# Altium schematic sheet Digital Inputs.SchDoc
size A4
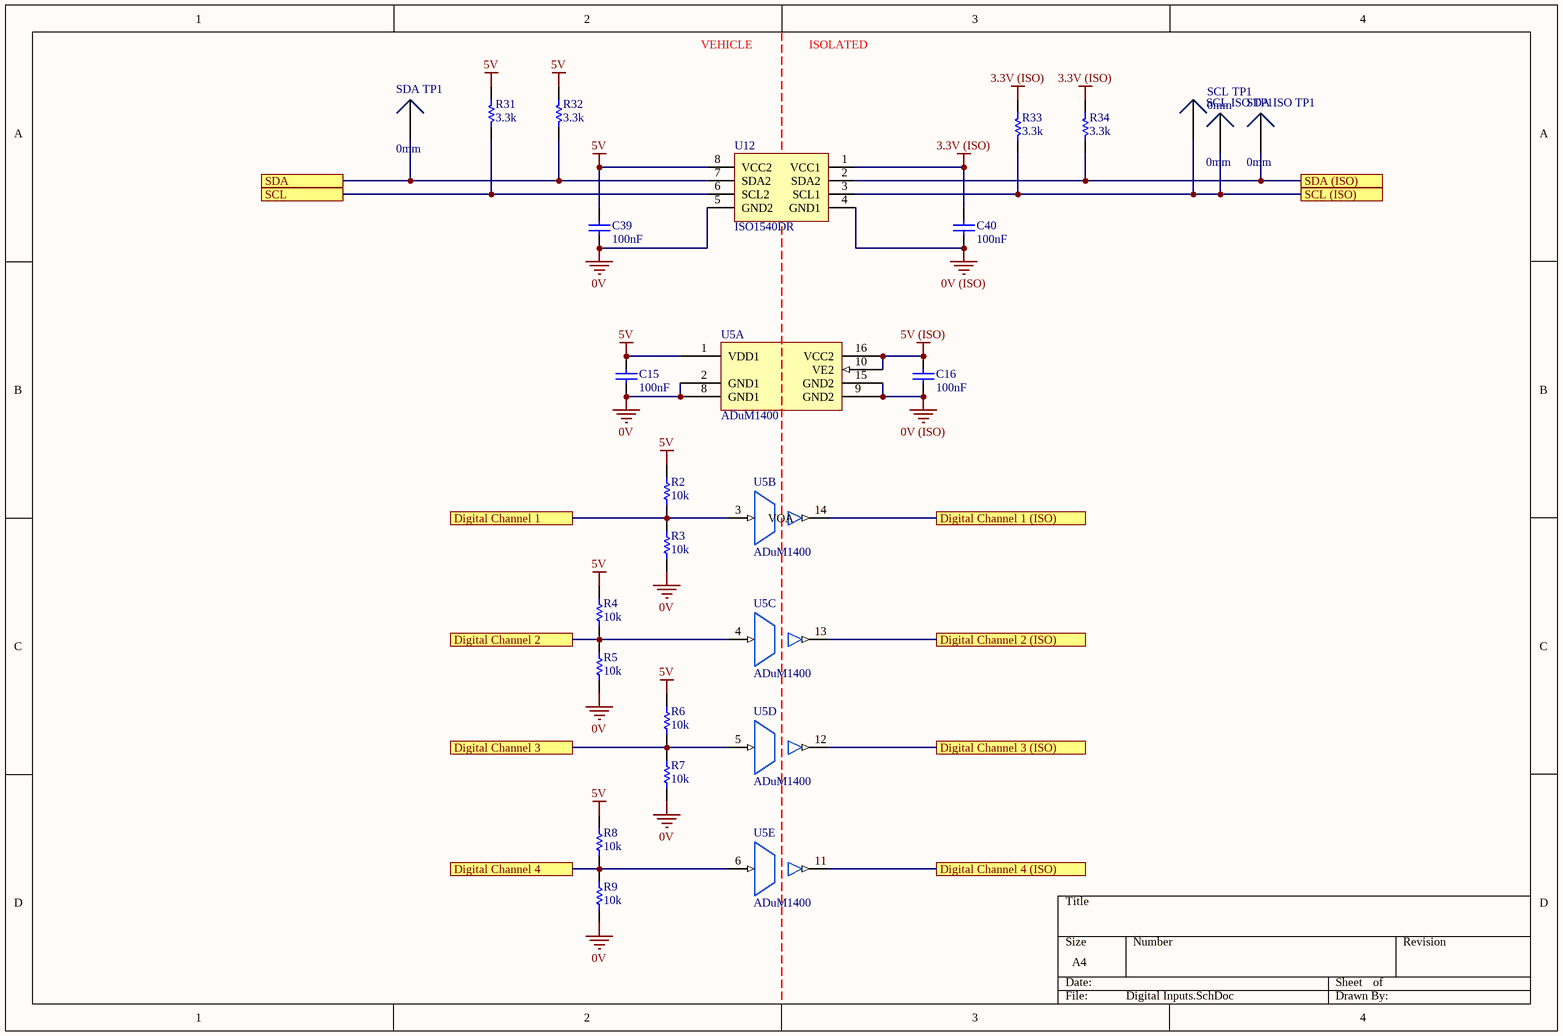
[diagram p0: Digital Inputs.SchDoc]

## Parts
C15  100nF  [0805]
C16  100nF  [0805]
C39  100nF  [0805]
C40  100nF  [0805]
R2  10k  [0805]
R3  10k  [0805]
R4  10k  [0805]
R5  10k  [0805]
R6  10k  [0805]
R7  10k  [0805]
R8  10k  [0805]
R9  10k  [0805]
R31  3.3k  [0805]
R32  3.3k  [0805]
R33  3.3k  [0805]
R34  3.3k  [0805]
SCL_ISO_TP1  0mm  [SMD Test Point]
SCL_TP1  0mm  [SMD Test Point]
SDA_ISO_TP1  0mm  [SMD Test Point]
SDA_TP1  0mm  [SMD Test Point]
U5  ADuM1400  [AD 16-SOIC]  (parts A,B,C,D,E of 5)
U12  ISO1540DR  [TI 8-SOIC]

## Ports
Digital Channel 1, Digital Channel 1 (ISO), Digital Channel 2, Digital Channel 2 (ISO), Digital Channel 3, Digital Channel 3 (ISO), Digital Channel 4, Digital Channel 4 (ISO), SCL, SCL (ISO), SDA, SDA (ISO)

## Nets
0V: C15.1 C39.1 R3.1 R5.1 R7.1 R9.1 U5.2(GND1) U5.8(GND1) U12.5(GND2)
0V (ISO): C16.1 C40.1 U5.9(GND2) U5.15(GND2) U12.4(GND1)
3.3V (ISO): C40.2 R33.2 R34.2 U12.1(VCC1)
5V: C15.2 C39.2 R2.2 R4.2 R6.2 R8.2 R31.2 R32.2 U5.1(VDD1) U12.8(VCC2)
5V (ISO): C16.2 U5.10(VE2) U5.16(VCC2)
Digital Channel 1: R2.1 R3.2 U5.3(VIA) ; port Digital Channel 1
Digital Channel 1 (ISO): U5.14(VOA) ; port Digital Channel 1 (ISO)
Digital Channel 2: R4.1 R5.2 U5.4(VIB) ; port Digital Channel 2
Digital Channel 2 (ISO): U5.13(VOB) ; port Digital Channel 2 (ISO)
Digital Channel 3: R6.1 R7.2 U5.5(VIC) ; port Digital Channel 3
Digital Channel 3 (ISO): U5.12(VOC) ; port Digital Channel 3 (ISO)
Digital Channel 4: R8.1 R9.2 U5.6(VID) ; port Digital Channel 4
Digital Channel 4 (ISO): U5.11(VOD) ; port Digital Channel 4 (ISO)
SCL: R31.1 U12.6(SCL2) ; port SCL
SCL (ISO): R33.1 SCL_ISO_TP1.1 SCL_TP1.1 U12.3(SCL1) ; port SCL (ISO)
SDA: R32.1 SDA_TP1.1 U12.7(SDA2) ; port SDA
SDA (ISO): R34.1 SDA_ISO_TP1.1 U12.2(SDA2) ; port SDA (ISO)

## Notes on the sheet
- VEHICLE
- ISOLATED

## Library data of the parts
C15 C16 C39 C40 = GCM21BR71E104KA37L: Manufacturer: muRata; Tolerance: 10%; Material: X7R; Rated Voltage: 25V; Part Number: GCM21BR71E104KA37L; Value: 100nF
R2-R9 = RC0805FR0710KL: Manufacturer: YAGEO; Tolerance: 0.01; Rated Voltage: 0.125W; Part Number: RC0805FR0710KL; Value: 10k; Material: FR-07
R31-R34 = RC0805FR073K3L: Manufacturer: YAGEO; Tolerance: 0.01; Rated Voltage: 0.125W; Part Number: RC0805FR073K3L; Value: 3.3k; Material: FR-07
SCL_ISO_TP1 SCL_TP1 SDA_ISO_TP1 SDA_TP1 = SMD Test Point: Positions: 1; Row Spacing: 0; Flange: No; Contact: NA; Part Number: SMD Test Point; Pitch: 0mm; Angle: 0
U5 = ADuM1400: General Purpose Digital Isolator 2500Vrms 4 Channel 1Mbps 25kV/µs CMTI 16-SOIC (0.295", 7.50mm Width); Manufacturer: Analog Devices; Part Number: ADuM1400; Digikey Part Number: ADUM1400WSRWZ-ND; Digikey Link: https://www.digikey.com/product-detail/en/analog-devices-inc/ADUM1400WSRWZ/ADUM1400WSRWZ-ND/1873713
U12 = ISO1540DR: I2C Digital Isolator (Multichannel); Manufacturer: Texas Instruments; Part Number: ISO1540DR; Digikey Part Number: 296-34871-1-ND; Digikey Link: https://www.digikey.com/product-detail/en/texas-instruments/ISO1540DR/296-34871-1-ND/3587214